# EAGLE design Main (EAGLE 9.2.2)
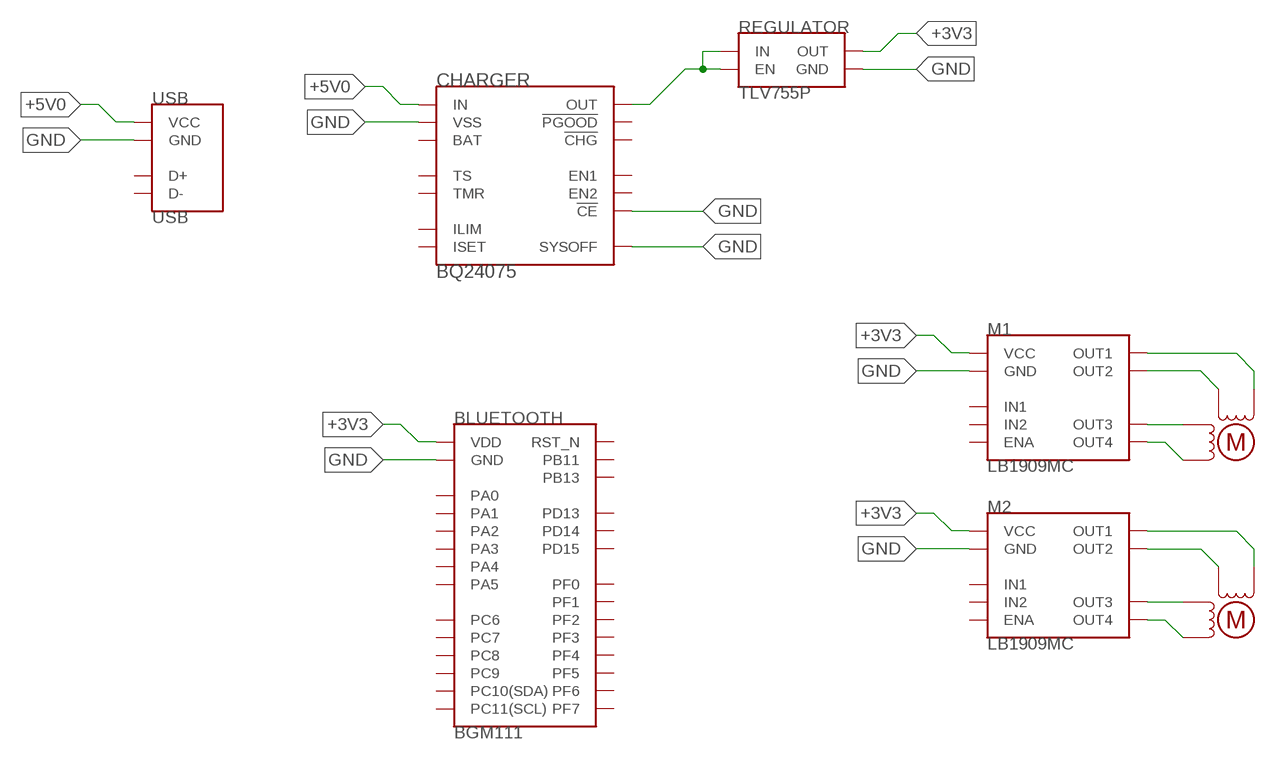
[diagram p0: schematic, sheet 1]

## Parts
BLUETOOTH  BGM111  [BGM111]
CHARGER  BQ24075  BQ24075BQ24075  [VQFN-16]
M1  LB1909MC  [SOIC-10]
M2  LB1909MC  [SOIC-10]
REGULATOR  TLV755P  [SOT-23-5]
U$3  MOTOR  [MOTOR]
U$4  MOTOR  [MOTOR]
USB  USB  [USB]

## Nets
+3V3: BLUETOOTH.VDD M1.1(VCC) M2.1(VCC) REGULATOR.5(OUT)
+5V0: CHARGER.13(IN) USB.1(VCC)
GND: BLUETOOTH.GND@0(GND) BLUETOOTH.GND@1(GND) BLUETOOTH.GND@2(GND) BLUETOOTH.GND@3(GND) CHARGER.4(!CE) CHARGER.8(VSS) CHARGER.15(SYSOFF) CHARGER.17(VSS) CHARGER.17@1(VSS) CHARGER.17@2(VSS) CHARGER.17@3(VSS) CHARGER.17@4(VSS) M1.6(GND) M2.6(GND) REGULATOR.2(GND) USB.5(GND) USB.GND@0(GND) USB.GND@1(GND) USB.GND@2(GND) USB.GND@3(GND)
N$1: CHARGER.10(OUT) CHARGER.11(OUT) REGULATOR.1(IN) REGULATOR.3(EN)
N$2: M1.7(OUT4) U$4.B2
N$3: M2.7(OUT4) U$3.B2
N$4: M2.8(OUT3) U$3.B1
N$5: M1.8(OUT3) U$4.B1
N$6: M1.9(OUT2) U$4.A1
N$7: M1.10(OUT1) U$4.A2
N$8: M2.9(OUT2) U$3.A1
N$9: M2.10(OUT1) U$3.A2
Unconnected: BLUETOOTH.PA0 BLUETOOTH.PA1 BLUETOOTH.PA2 BLUETOOTH.PA3 BLUETOOTH.PA4 BLUETOOTH.PA5 BLUETOOTH.PB11 BLUETOOTH.PB13 BLUETOOTH.PC6 BLUETOOTH.PC7 BLUETOOTH.PC8 BLUETOOTH.PC9 BLUETOOTH.PC10(PC10(SDA)) BLUETOOTH.PC11(PC11(SCL)) BLUETOOTH.PD13 BLUETOOTH.PD14 BLUETOOTH.PD15 BLUETOOTH.PF0 BLUETOOTH.PF1 BLUETOOTH.PF2 BLUETOOTH.PF3 BLUETOOTH.PF4 BLUETOOTH.PF5 BLUETOOTH.PF6 BLUETOOTH.PF7 BLUETOOTH.RST_N CHARGER.1(TS) CHARGER.2(BAT) CHARGER.3(BAT) CHARGER.5(EN2) CHARGER.6(EN1) CHARGER.7(!PGOOD) CHARGER.9(!CHG) CHARGER.12(ILIM) CHARGER.14(TMR) CHARGER.16(ISET) M1.2(ENA) M1.3(IN1) M1.4(IN2) M2.2(ENA) M2.3(IN1) M2.4(IN2) USB.2(D-) USB.3(D+)

## Library data of the parts
BLUETOOTH = Main Components:BGM111: Bluetooth Module Silicon Labs BGM111 Integrated ARM Cortex M4, 32kB RAM, 256kB Flash Mouser <https://www.mouser.com/ProductDetail/BGM111E256V2> Silicon Labs <https://www.silabs.com/products/wireless/bluetooth/bluetooth-low-energy-modules/bgm111-bluetooth-low-energy-module>
CHARGER = Main Components:BQ24075: LiPo Battery Managment The bq2407x series of devices are integrated Li-Ion linear chargers and system power path management devices targeted at space-limited portable applications. The devices operate from either a USB port or an AC adapter and support charge currents up to 1.5 A. The input voltage range with input overvoltage protection supports unregulated adapters. The USB input current limit accuracy and start up sequence allow the bq2407x to meet USB-IF inrush current specifications. Additionally, the input dynamic power management (V IN -DPM) prevents the charger from crashing incorrectly configured USB sources. Mouser <https://www.mouser.com/ProductDetail/BQ24075RGTR>
M1 M2 = Components:LB1909MC
REGULATOR = Components:TLV755P: 3.3V LDO Regulator The TLV755P is an ultra-small, low quiescent current, low-dropout regulator (LDO) that sources 500mA with good line and load transient performance. The TLV755P is optimized for a wide variety of applications by supporting and input voltage range from 1.45 V to 5.5 V. To minimize cost and solution size, the device is offered in fixed output voltages ranging from 0.6 V to 5V to support lower core voltages of modern microcontrollers (MCUs). Additionally, the TLV755P has a low IQ with enable functionality to minimize standby power. This device features an internal soft-start to lower inrush current, thus providing a controlled voltage to the load and minimizing the input voltage drop during start up. When shutdown, the device actively pulls down the output to quickly discharge the outputs and ensure a known start-up state. Mouser <https://www.mouser.com/ProductDetail/TLV75533PDBVR>
U$3 U$4 = Components:MOTOR
USB = Components:USB

## Board
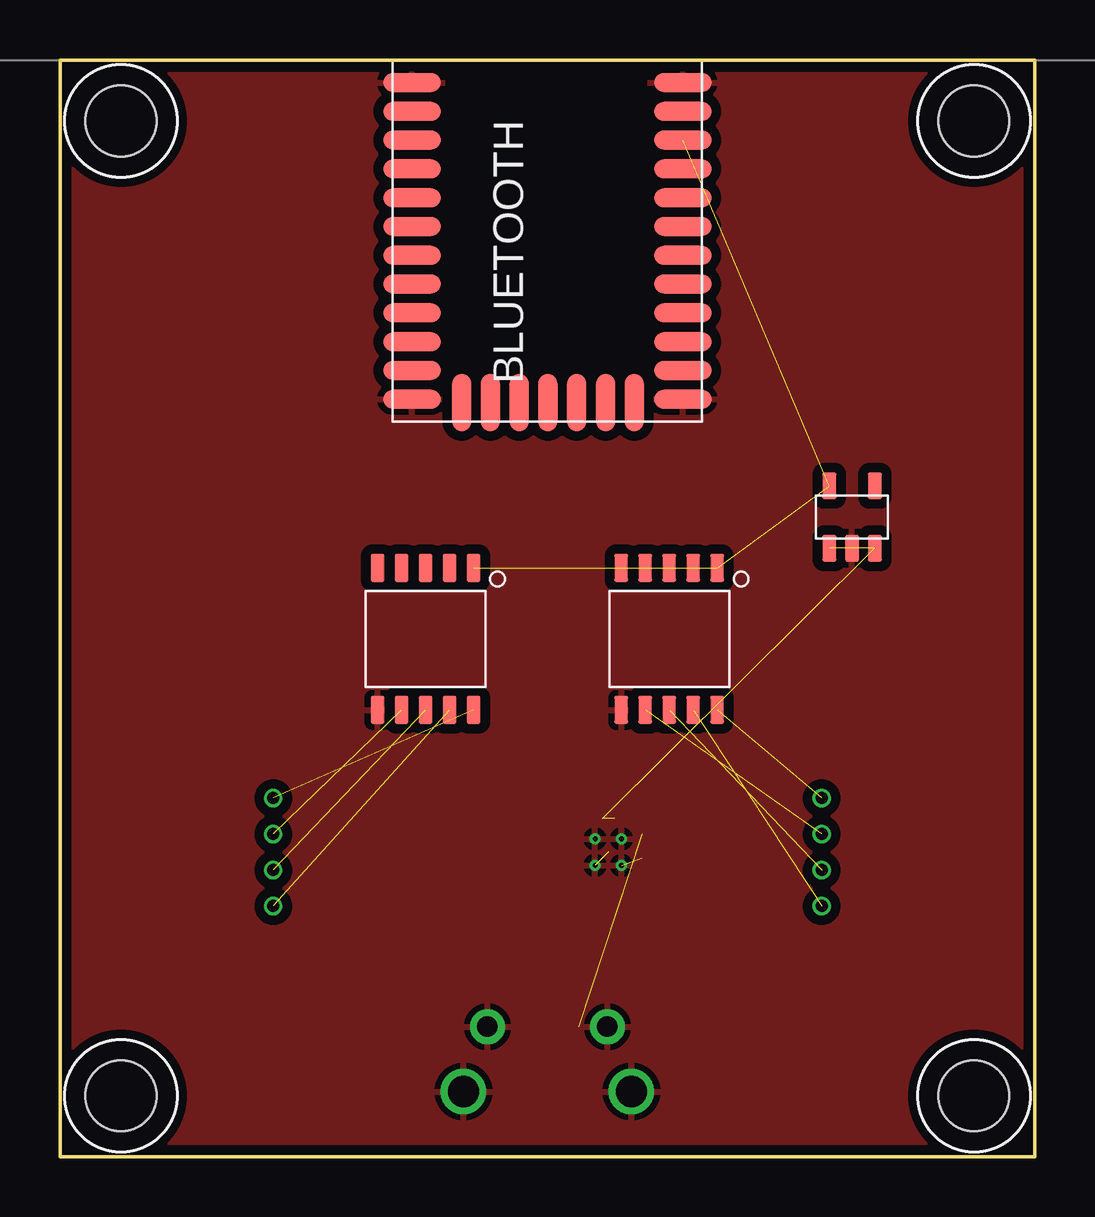
[diagram p1: board, top side]
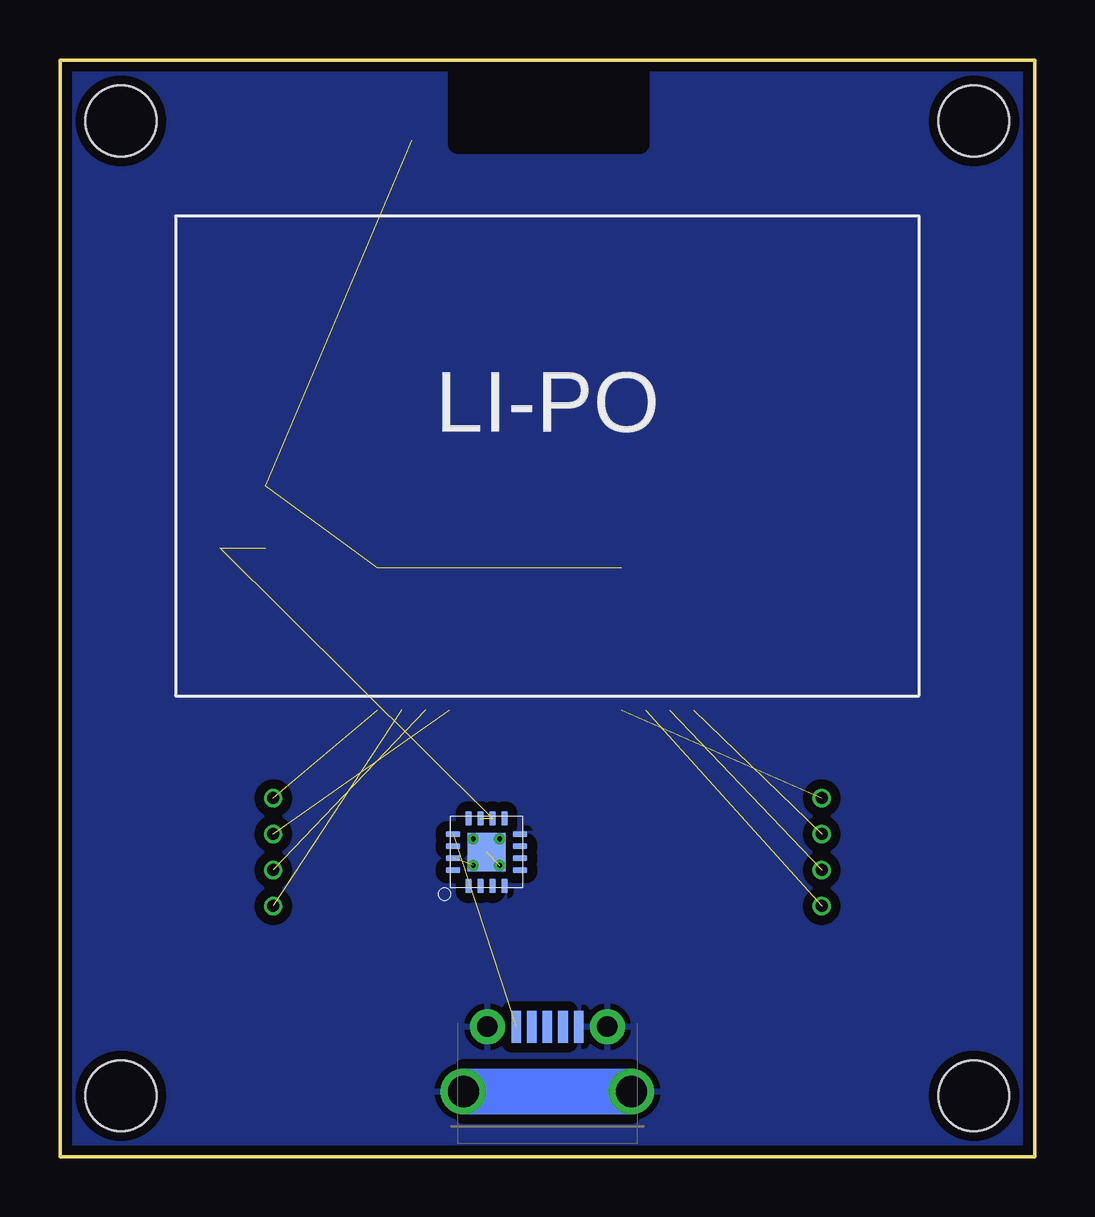
[diagram p2: board, bottom side, seen from below]

Size 40.64 x 45.72 mm. Coordinates in mm from the lower left corner, seen from the top.
Outline: 0,0 0,45.72 40.64,45.72 40.64,0 0,0
Copper layers (1*16): Top 0.035mm / dielectric 1.5mm / Bottom 0.035mm
Design rules "OshPark *": minimum track width 6mil, minimum drill 10mil, track to track 6mil, track to pad 6mil, pad to pad 6mil, via to via 6mil, smd to smd 6mil, copper to edge 15mil, drill to drill 6mil, minimum pad ring 5mil, minimum via ring 5mil, stop-mask expansion 2mil, vias tented up to drill 0mil, thermal gap 10mil

### Footprints (pad centres in the part's own frame; a part is rotated, then mirrored left to right if it is on the bottom)
BGM111 = smd 2.4 x 0.8: GND@0 -5.65,-0.94; GND@1 -5.65,-14.14; GND@2 5.65,-14.14; GND@3 5.65,-0.94; PA0 -5.65,-5.74; PA1 -5.65,-6.94; PA2 -5.65,-8.14; PA3 -5.65,-9.34; PA4 -5.65,-10.54; PA5 -5.65,-11.74; PB11 -5.65,-12.94; PD13 -5.65,-2.14; PD14 -5.65,-3.34; PD15 -5.65,-4.54; PF0 5.65,-12.94; PF1 5.65,-11.74; PF2 5.65,-10.54; PF3 5.65,-9.34; PF4 5.65,-8.14; PF5 5.65,-6.94; PF6 5.65,-5.74; PF7 5.65,-4.54; RST_N 5.65,-2.14; VDD 5.65,-3.34 | smd 0.8 x 2.4: PB13 -3.58,-14.28; PC6 -2.38,-14.28; PC7 -1.18,-14.28; PC8 0.02,-14.28; PC9 1.22,-14.28; PC10 2.42,-14.28; PC11 3.62,-14.28
VQFN-16 = smd 0.6 x 0.25: 1 -1.4,0.75; 2 -1.4,0.25; 3 -1.4,-0.25; 4 -1.4,-0.75; 9 1.4,-0.75; 10 1.4,-0.25; 11 1.4,0.25; 12 1.4,0.75 | smd 0.25 x 0.6: 5 -0.75,-1.4; 6 -0.25,-1.4; 7 0.25,-1.4; 8 0.75,-1.4; 13 0.75,1.4; 14 0.25,1.4; 15 -0.25,1.4; 16 -0.75,1.4 | smd 1.6 x 1.6: 17 0,0 | drill 0.2 pad 0.254: 17@1 -0.55,0.55; 17@2 -0.55,-0.55; 17@3 0.55,-0.55; 17@4 0.55,0.55
SOIC-10 = smd 1.18 x 0.58: 1 -2.96,2; 2 -2.96,1; 3 -2.96,0; 4 -2.96,-1; 5 -2.96,-2; 6 2.96,-2; 7 2.96,-1; 8 2.96,0; 9 2.96,1; 10 2.96,2
SOT-23-5 = smd 1.1 x 0.6: 1 -1.3,0.95; 2 -1.3,0; 3 -1.3,-0.95; 4 1.3,-0.95; 5 1.3,0.95
#4_SCREW = hole 2.946: 0,0
MOTOR = drill 0.5: A1 -2.25,0; A2 2.25,0; B1 -0.75,0; B2 0.75,0
USB = smd 0.4 x 1.35: 1 -1.3,4.15; 2 -0.65,4.15; 3 0,4.15; 4 0.65,4.15; 5 1.3,4.15 | drill 0.85 pad 1.45: GND@0 -2.5,4.15; GND@3 2.5,4.15 | drill 1.3 pad 1.9: GND@1 -3.5,1.45; GND@2 3.5,1.45

### Placement (x,y rotation side)
BLUETOOTH  20.32,45.72 0 top
CHARGER  22.86,12.7 90 bottom
LI-PO  500mAh  [BATTERY]  20.32,29.21 0 bottom
M1  15.24,21.59 270 top
M2  25.4,21.59 270 top
REGULATOR  33.02,26.67 90 top
U$1  [#4_SCREW]  2.54,43.18 0 top
U$2  [#4_SCREW]  38.1,43.18 0 top
U$3  31.75,12.7 90 bottom
U$4  8.89,12.7 90 bottom
U$5  [#4_SCREW]  2.54,2.54 0 top
U$6  [#4_SCREW]  38.1,2.54 0 top
USB  20.32,1.27 0 bottom

### Tracks (layer width: path | path; a pad name or v marks a point on that pad's centre or on a via)
+3V3  (3 unrouted)
+5V0  (1 unrouted)
GND  (2 unrouted)
  pour Top (isolate 0.406): 0,45.72 40.64,45.72 40.64,0 0,0
  pour Bottom (isolate 0.406): 0,45.72 40.64,45.72 40.64,0 0,0
N$1  (3 unrouted)
N$2  (1 unrouted)
N$3  (1 unrouted)
N$4  (1 unrouted)
N$5  (1 unrouted)
N$6  (1 unrouted)
N$7  (1 unrouted)
N$8  (1 unrouted)
N$9  (1 unrouted)